# EAGLE design VAST (EAGLE 9.4.2)
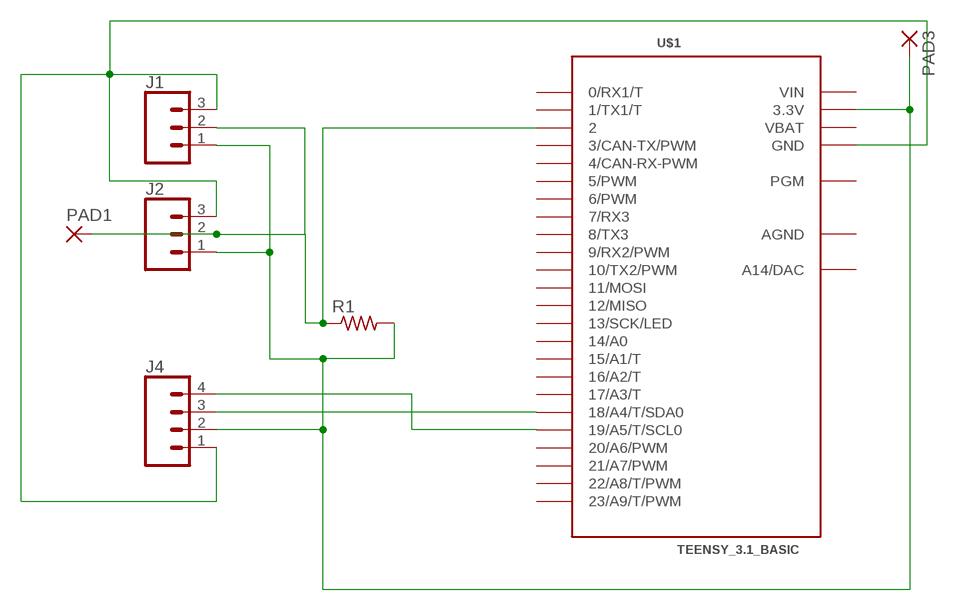
[diagram p0: schematic, sheet 1]

## Parts
J1  CONN_03POLAR_LOCK  [MOLEX-1X3_LOCK]
J2  CONN_03POLAR_LOCK  [MOLEX-1X3_LOCK]
J4  CONN_04POLAR  [MOLEX-1X4]
PAD1  SMD5  [SMD2,54-5,08]
PAD3  SMD5  [SMD2,54-5,08]
R1  ADAFRUIT_R-US_0207/10  [ADAFRUIT_0207/10]
U$1  TEENSY_3.1_BASIC  [TEENSY_3.1_BASIC]

## Nets
N$1: J1.2 J2.2 PAD1.1(P) R1.1 U$1.2
N$2: J1.1 J2.1 J4.2 PAD3.1(P) R1.2 U$1.3.3V U$1.3.3V1(3.3V)
N$3: J4.3 U$1.18/A4(18/A4/T/SDA0)
N$4: J4.4 U$1.19/A5(19/A5/T/SCL0)
N$13: J1.3 J2.3 J4.1 U$1.GND U$1.GND1(GND)
Unconnected: U$1.0(0/RX1/T) U$1.1(1/TX1/T) U$1.3(3/CAN-TX/PWM) U$1.4(4/CAN-RX-PWM) U$1.5(5/PWM) U$1.6(6/PWM) U$1.7(7/RX3) U$1.8(8/TX3) U$1.9(9/RX2/PWM) U$1.10(10/TX2/PWM) U$1.11(11/MOSI) U$1.12(12/MISO) U$1.13(13/SCK/LED) U$1.14/A0 U$1.15/A1(15/A1/T) U$1.16/A2(16/A2/T) U$1.17/A3(17/A3/T) U$1.20/A6(20/A6/PWM) U$1.21/A7(21/A7/PWM) U$1.22/A8(22/A8/T/PWM) U$1.23/A9(23/A9/T/PWM) U$1.A14(A14/DAC) U$1.PGM

## Power pins joined to a net without a drawn wire
AGND: U$1.AGND
VBAT: U$1.VBAT
VIN: U$1.VIN

## Library data of the parts
J1 J2 = SparkFun-Connectors:CONN_03: Multi connection point. Often used as Generic Header-pin footprint for 0.1 inch spaced/style header connections On any of the 0.1 inch spaced packages, you can populate with these: Break Away Headers - Straight <https://www.sparkfun.com/products/116> (PRT-00116) Break Away Male Headers - Right Angle <https://www.sparkfun.com/products/553> (PRT-00553) Female Headers <https://www.sparkfun.com/products/115> (PRT-00115) Break Away Headers - Machine Pin <https://www.sparkfun.com/products/117> (PRT-00117) Break Away Female Headers - Swiss Machine Pin <https://www.sparkfun.com/products/743> (PRT-00743) Stackable Header - 3 Pin (Female, 0.1") <https://www.sparkfun.com/products/13875> (PRT-13875) For SCREWTERMINALS and SPRING TERMINALS visit here: Screw Terimnals on SparkFun.com <https://www.sparkfun.com/search/results?term=Screw+Terminals> (5mm/3.5mm/2.54mm spacing) This device is also useful as a general connection point to wire up your design to another part of your project. Our various solder wires solder well into these plated through hole pads. Hook-Up Wire - Assortment (Stranded, 22 AWG) <https://www.sparkfun.com/products/11375> (PRT-11375) Hook-Up Wire - Assortment (Solid Core, 22 AWG) <https://www.sparkfun.com/products/11367> (PRT-11367) View the entire wire category on our website here <https://www.sparkfun.com/categories/141> Special notes: Molex polarized connector foot print use with SKU : PRT-08232 with associated crimp pins and housings.; PROD_ID: CONN-08625; SF_ID: PRT-08096
J4 = SparkFun-Connectors:CONN_04: Multi connection point. Often used as Generic Header-pin footprint for 0.1 inch spaced/style header connections On any of the 0.1 inch spaced packages, you can populate with these: Break Away Headers - Straight <https://www.sparkfun.com/products/116> (PRT-00116) Break Away Male Headers - Right Angle <https://www.sparkfun.com/products/553> (PRT-00553) Female Headers <https://www.sparkfun.com/products/115> (PRT-00115) Break Away Headers - Machine Pin <https://www.sparkfun.com/products/117> (PRT-00117) Break Away Female Headers - Swiss Machine Pin <https://www.sparkfun.com/products/743> (PRT-00743) For SCREWTERMINALS and SPRING TERMINALS visit here: Screw Terimnals on SparkFun.com <https://www.sparkfun.com/search/results?term=Screw+Terminals> (5mm/3.5mm/2.54mm spacing) This device is also useful as a general connection point to wire up your design to another part of your project. Our various solder wires solder well into these plated through hole pads. Hook-Up Wire - Assortment (Stranded, 22 AWG) <https://www.sparkfun.com/products/11375> (PRT-11375) Hook-Up Wire - Assortment (Solid Core, 22 AWG) <https://www.sparkfun.com/products/11367> (PRT-11367) View the entire wire category on our website here <https://www.sparkfun.com/categories/141> Special notes: Molex polarized connector foot print use with SKU : PRT-08231 with associated crimp pins and housings. 1MM SMD Version SKU: PRT-10208; PROD_ID: CONN-08186; SF_ID: PRT-08231
PAD1 PAD3 = wirepad:SMD5: SMD PAD
R1 = SECTION A:ADAFRUIT_R-US_: RESISTOR, American symbol
U$1 = Teensy_3_Series_Board_v1.0:TEENSY_3.1_BASIC: Footprint for Teensy 3.1 board using all pin connections on the outer perimeter

## Board
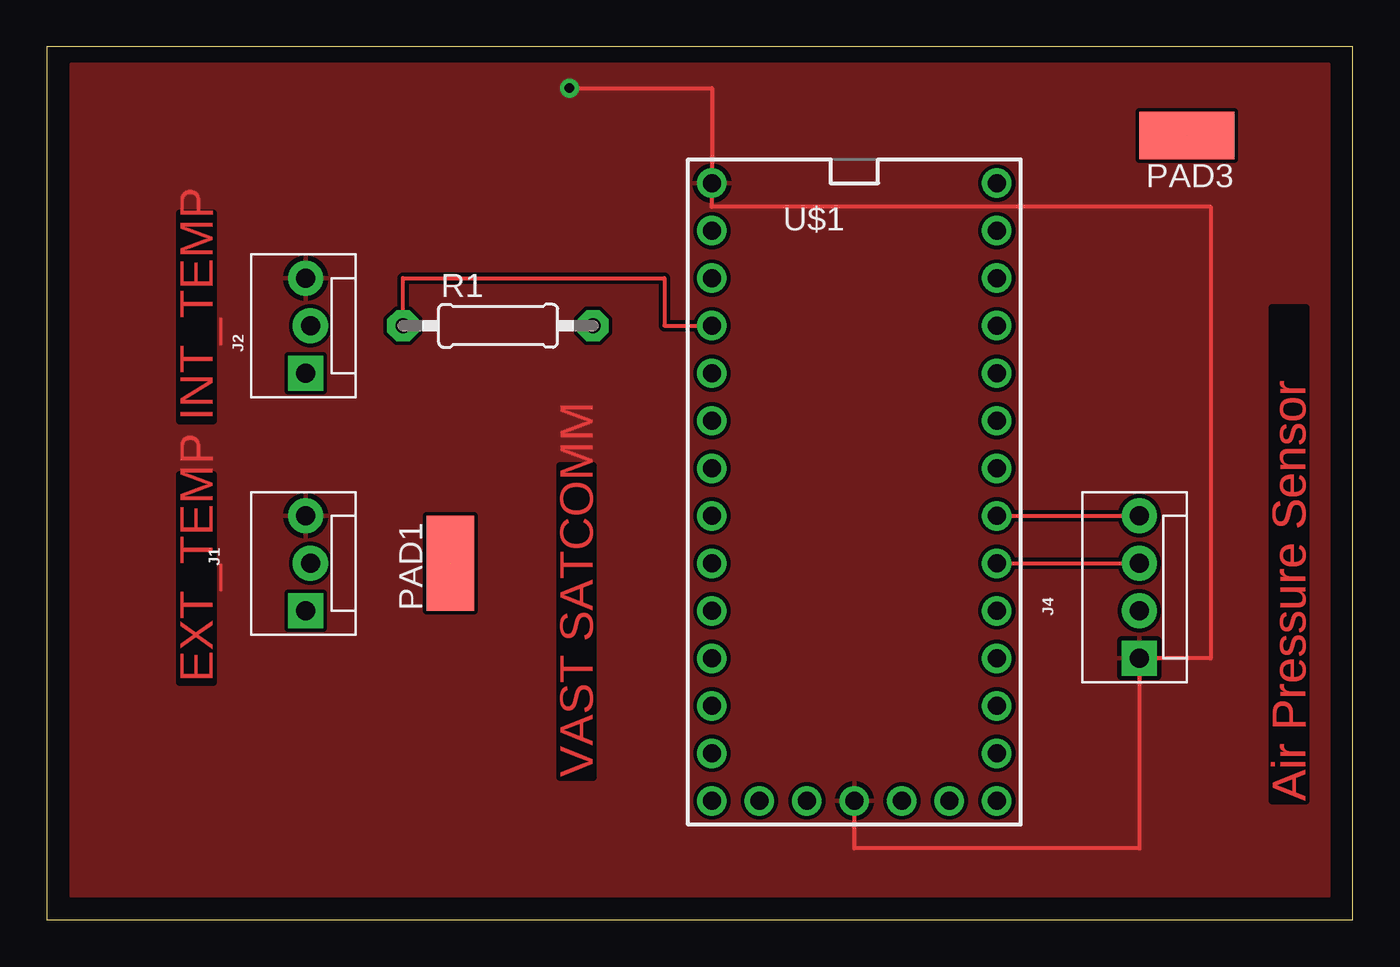
[diagram p1: board, top side]
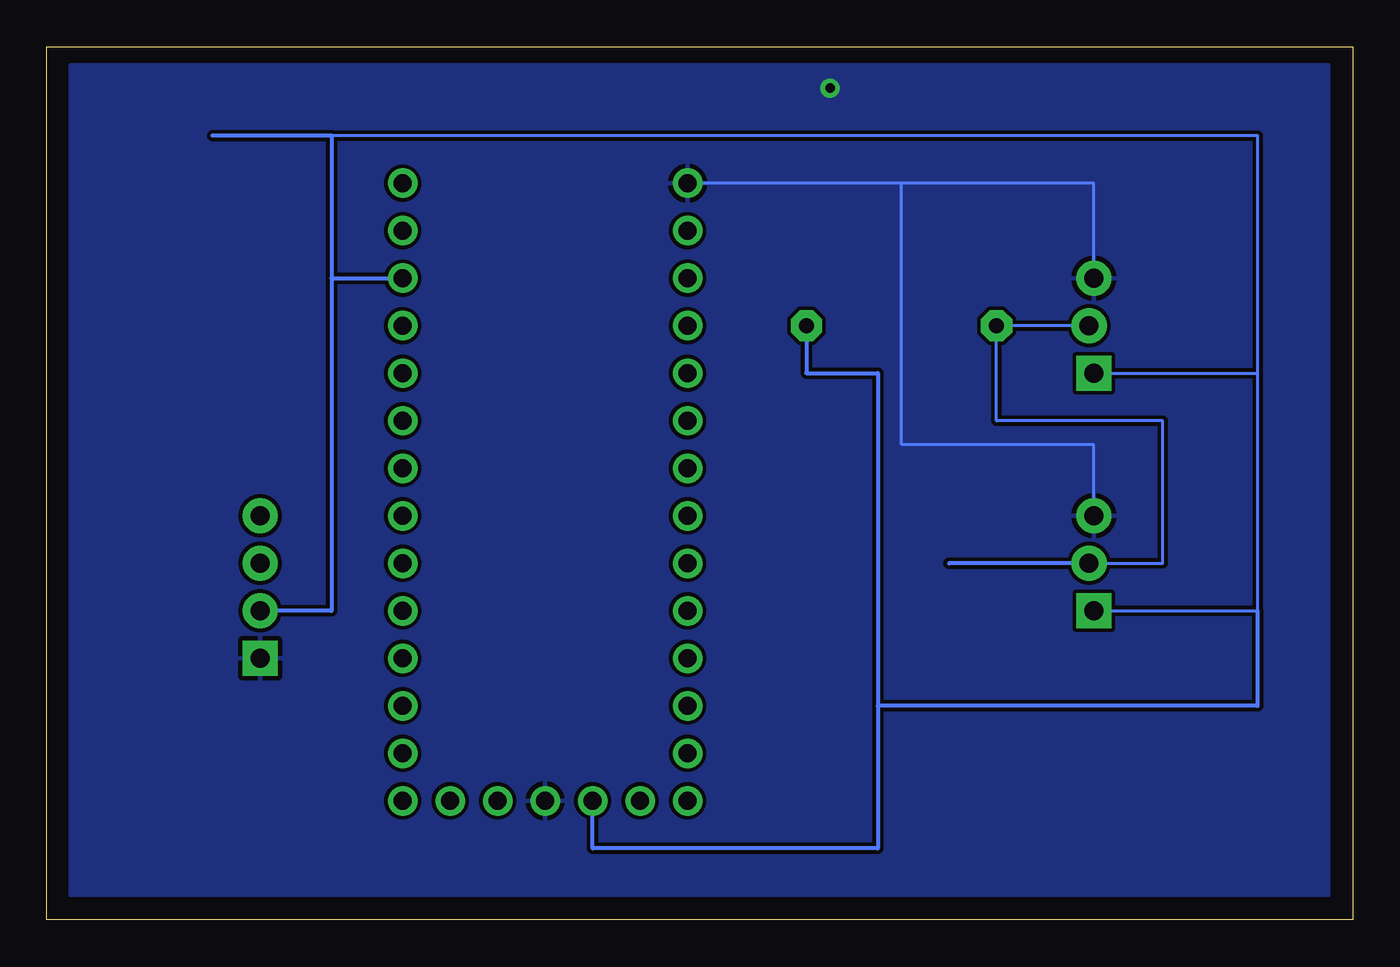
[diagram p2: board, bottom side, seen from below]

Size 69.83 x 46.66 mm. Coordinates in mm from the lower left corner, seen from the top.
Outline: 0,0 69.83,0 69.83,46.66 0,46.66 0,0
Copper layers (1*16): Top 0.035mm / dielectric 1.5mm / Bottom 0.035mm
Design rules "SparkFun *": minimum track width 8mil, minimum drill 20mil, track to track 8mil, track to pad 8mil, pad to pad 8mil, via to via 8mil, smd to smd 8mil, copper to edge 8mil, drill to drill 8mil, minimum pad ring 12mil, minimum via ring 10mil, stop-mask expansion 4mil, vias tented up to drill 20mil, thermal gap 10mil

### Footprints (pad centres in the part's own frame; a part is rotated, then mirrored left to right if it is on the bottom)
MOLEX-1X3_LOCK = drill 1.016 pad 1.88 square: 1 0,0.127 | drill 1.016 pad 1.88: 2 2.54,-0.127; 3 5.08,0.127
MOLEX-1X4 = drill 1.016 pad 1.88 square: 1 0,0 | drill 1.016 pad 1.88: 2 2.54,0; 3 5.08,0; 4 7.62,0
SMD2,54-5,08 = smd 2.54 x 5.08: 1 0,0
ADAFRUIT_0207/10 = drill 0.813 pad 1.676 octagon: 1 -5.08,0; 2 5.08,0
TEENSY_3.1_BASIC = drill 0.965: 0 -7.62,13.97; 1 -7.62,11.43; 2 -7.62,8.89; 3 -7.62,6.35; 3.3V 7.62,11.43; 3.3V1 -2.54,-16.51; 4 -7.62,3.81; 5 -7.62,1.27; 6 -7.62,-1.27; 7 -7.62,-3.81; 8 -7.62,-6.35; 9 -7.62,-8.89; 10 -7.62,-11.43; 11 -7.62,-13.97; 12 -7.62,-16.51; 13 7.62,-16.51; 14/A0 7.62,-13.97; 15/A1 7.62,-11.43; 16/A2 7.62,-8.89; 17/A3 7.62,-6.35; 18/A4 7.62,-3.81; 19/A5 7.62,-1.27; 20/A6 7.62,1.27; 21/A7 7.62,3.81; 22/A8 7.62,6.35; 23/A9 7.62,8.89; A14 5.08,-16.51; AGND 7.62,13.97; GND -7.62,16.51; GND1 0,-16.51; PGM 2.54,-16.51; VBAT -5.08,-16.51; VIN 7.62,16.51

### Placement (x,y rotation side)
J1  13.97,16.51 90 top
J2  13.97,29.21 90 top
J4  58.42,13.97 90 top
PAD1  21.59,19.05 0 top
PAD3  60.96,41.91 90 top
R1  24.13,31.75 0 top
U$1  43.18,22.86 0 top

### Tracks (layer width: path | path; a pad name or v marks a point on that pad's centre or on a via)
N$1  (1 unrouted)
  Top 0.203: R1.1 19.05,34.29 33.02,34.29 33.02,31.75 U$1.2
  Bottom 0.152: J2.2 R1.1 19.05,26.67 10.16,26.67 10.16,19.05 J1.2
  Bottom 0.203: J1.2 PAD1.1
N$2  (1 unrouted)
  Bottom 0.152: J2.1 5.08,29.21 | J1.1 5.08,16.51 5.08,29.21 | 5.08,29.21 5.08,41.91 54.61,41.91
  Bottom 0.203: R1.2 29.21,29.21 25.4,29.21 25.4,11.43 | 25.4,11.43 5.08,11.43 5.08,16.51 | 54.61,34.29 54.61,41.91 PAD3.1 | 54.61,34.29 U$1.3.3V | 54.61,34.29 54.61,16.51 J4.2 | 25.4,11.43 25.4,3.81 40.64,3.81 U$1.3.3V1
N$3
  Top 0.203: U$1.18/A4 J4.3
N$4
  Top 0.203: U$1.19/A5 J4.4
N$13  (via drill 0.51)
  Top 0.203: U$1.GND1 43.18,3.81 58.42,3.81 J4.1 62.23,13.97 62.23,38.1 35.56,38.1 U$1.GND 35.56,44.45 v27.94,44.45
  Bottom 0.152: J2.3 13.84,39.37 24.13,39.37 | 24.13,39.37 U$1.GND | J1.3 13.84,25.4 24.13,25.4 24.13,39.37
  pour Top: 39.37,45.72 1.27,45.72 1.27,1.27 2.54,1.27 68.58,1.27 68.58,2.54 68.58,45.72 66.04,45.72
  pour Bottom: 1.27,45.72 1.27,1.27 68.58,1.27 68.58,45.72

### Text on the board
Top: INT_TEMP | EXT_TEMP | VAST SATCOMM | Air Pressure Sensor | Air Pressure Sensor | Air Pressure Sensor